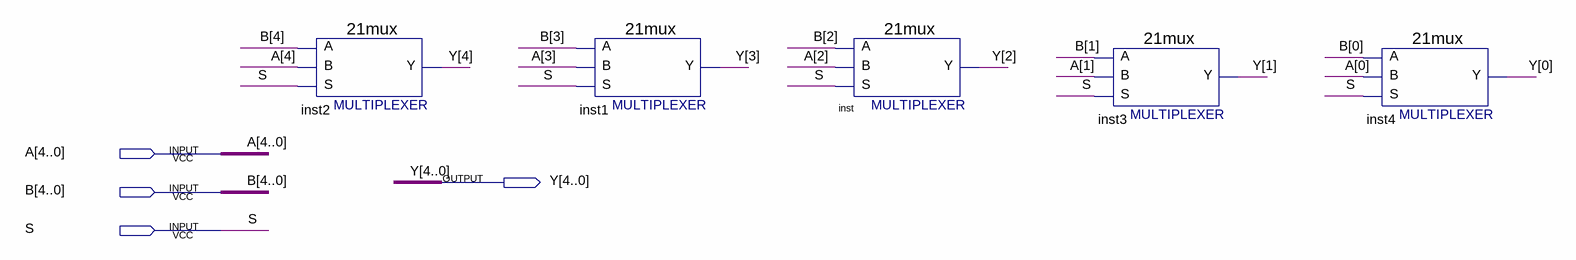
[diagram p0: schematic sheet]
// Quartus schematic MUX21_5BIT.bdf as structural Verilog: 5 symbols, 4 pins
module MUX21_5BIT (
  input  [4:0] A,
  input  [4:0] B,
  input  S,
  output [4:0] Y
);

  \21mux  inst2 (.S(S), .B(A[4]), .A(B[4]), .Y(Y[4]));
  \21mux  inst1 (.S(S), .B(A[3]), .A(B[3]), .Y(Y[3]));
  \21mux  inst (.S(S), .B(A[2]), .A(B[2]), .Y(Y[2]));
  \21mux  inst3 (.S(S), .B(A[1]), .A(B[1]), .Y(Y[1]));
  \21mux  inst4 (.S(S), .B(A[0]), .A(B[0]), .Y(Y[0]));
endmodule
